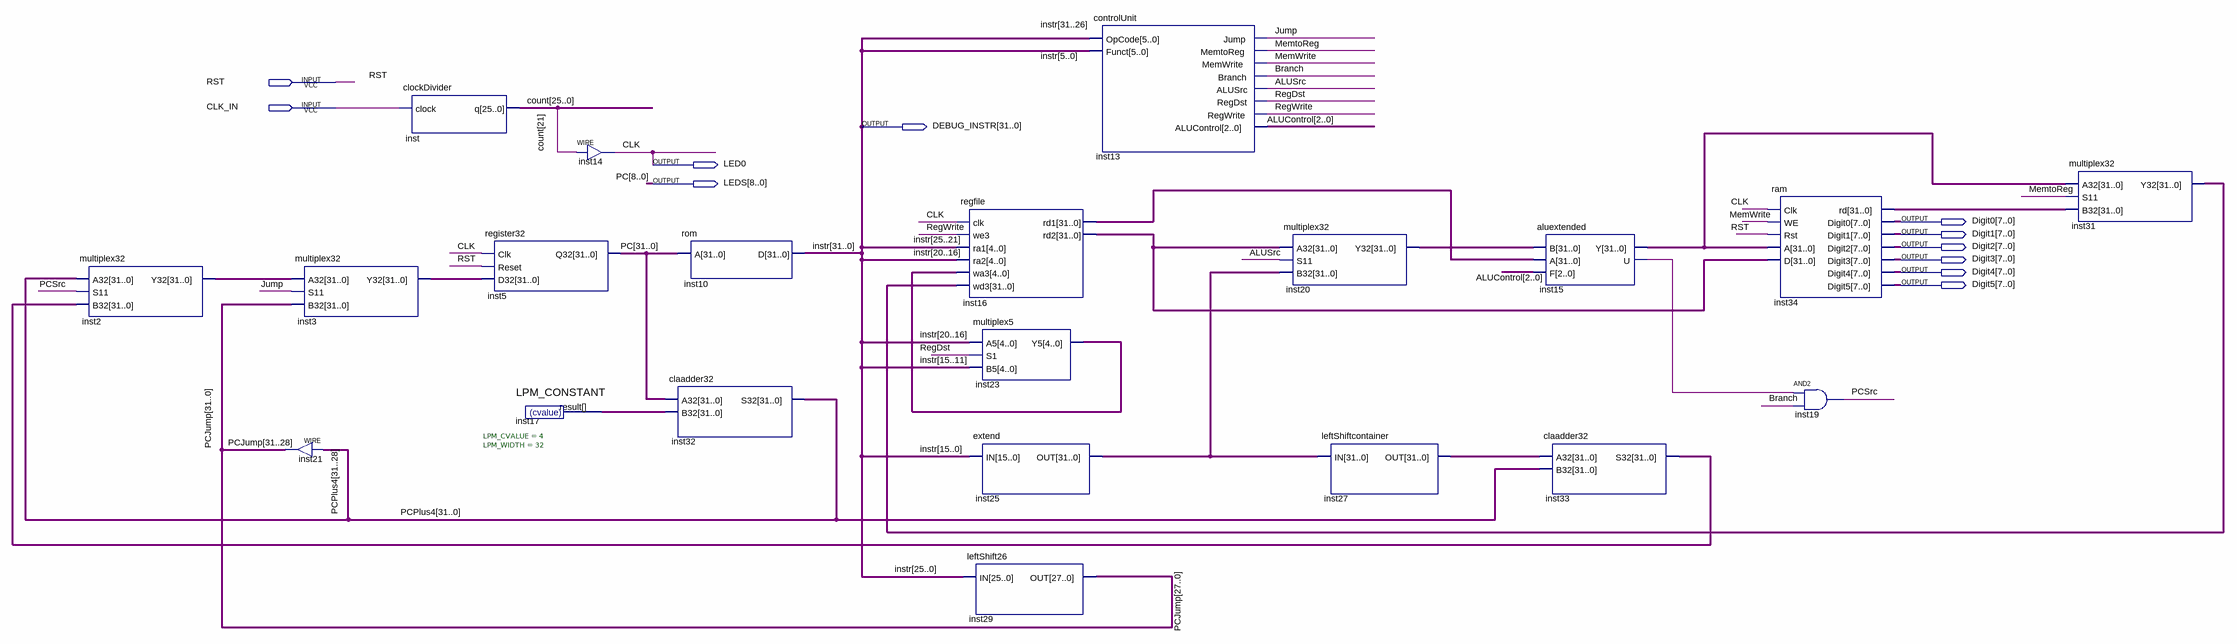
[diagram p0: schematic sheet]
// Quartus schematic processorv2.bdf as structural Verilog: 21 symbols, 11 pins
module processorv2 (
  input  RST,
  input  CLK_IN,
  output [31:0] DEBUG_INSTR,
  output LED0,
  output [8:0] LEDS,
  output [7:0] Digit0,
  output [7:0] Digit1,
  output [7:0] Digit2,
  output [7:0] Digit3,
  output [7:0] Digit4,
  output [7:0] Digit5
);

  wire ALUSrc, Branch, inst15_u, Jump, MemtoReg, MemWrite, PCSrc, RegDst, RegWrite;
  wire [2:0] ALUControl;
  wire [4:0] inst23_y5;
  wire [25:0] count;
  wire [31:0] inst2_y32, inst3_y32, inst15_y, inst16_rd1, inst16_rd2, inst17_result, inst20_y32, inst25_out,
       inst27_out, inst31_y32, inst33_s32, inst34_rd, PCJump, PCPlus4;
  wire [31:9] PC;

  multiplex32 inst2 (.A32(PCPlus4), .S11(PCSrc), .B32(inst33_s32), .Y32(inst2_y32));
  multiplex32 inst3 (.A32(inst2_y32), .S11(Jump), .B32(PCJump), .Y32(inst3_y32));
  assign PCJump[31:28] = PCPlus4[31:28];  // WIRE inst21
  clockDivider inst (.clock(CLK_IN), .q(count));
  register32 inst5 (.Clk(LED0), .Reset(RST), .D32(inst3_y32), .Q32({PC, LEDS}));
  LPM_CONSTANT #(.LPM_CVALUE(4), .LPM_WIDTH(32)) inst17 (.result(inst17_result));
  assign LED0 = count[21];  // WIRE inst14
  rom inst10 (.A({PC, LEDS}), .D(DEBUG_INSTR));
  claadder32 inst32 (.A32({PC, LEDS}), .B32(inst17_result), .S32(PCPlus4));
  regfile inst16 (
    .clk(LED0), .we3(RegWrite), .ra1(DEBUG_INSTR[25:21]), .ra2(DEBUG_INSTR[20:16]), .wa3(inst23_y5),
    .wd3(inst31_y32), .rd1(inst16_rd1), .rd2(inst16_rd2));
  multiplex5 inst23 (.A5(DEBUG_INSTR[20:16]), .S1(RegDst), .B5(DEBUG_INSTR[15:11]), .Y5(inst23_y5));
  extend inst25 (.IN(DEBUG_INSTR[15:0]), .OUT(inst25_out));
  leftShift26 inst29 (.IN(DEBUG_INSTR[25:0]), .OUT(PCJump[27:0]));
  controlUnit inst13 (
    .OpCode(DEBUG_INSTR[31:26]), .Funct(DEBUG_INSTR[5:0]), .Jump(Jump), .MemtoReg(MemtoReg),
    .MemWrite(MemWrite), .Branch(Branch), .ALUSrc(ALUSrc), .RegDst(RegDst), .RegWrite(RegWrite),
    .ALUControl(ALUControl));
  multiplex32 inst20 (.A32(inst16_rd2), .S11(ALUSrc), .B32(inst25_out), .Y32(inst20_y32));
  leftShiftcontainer inst27 (.IN(inst25_out), .OUT(inst27_out));
  aluextended inst15 (.B(inst20_y32), .A(inst16_rd1), .F(ALUControl), .Y(inst15_y), .U(inst15_u));
  claadder32 inst33 (.A32(inst27_out), .B32(PCPlus4), .S32(inst33_s32));
  ram inst34 (
    .Clk(LED0), .WE(MemWrite), .Rst(RST), .A(inst15_y), .D(inst16_rd2), .rd(inst34_rd), .Digit0(Digit0),
    .Digit1(Digit1), .Digit2(Digit2), .Digit3(Digit3), .Digit4(Digit4), .Digit5(Digit5));
  and inst19 (PCSrc, inst15_u, Branch);
  multiplex32 inst31 (.A32(inst15_y), .S11(MemtoReg), .B32(inst34_rd), .Y32(inst31_y32));

  // Other names for the same wires on the sheet: CLK = LED0; instr[31:0] = DEBUG_INSTR; PC[8:0] = LEDS
endmodule
